# EAGLE design plinkykeeb_21Jan2022 (EAGLE 9.6.2)
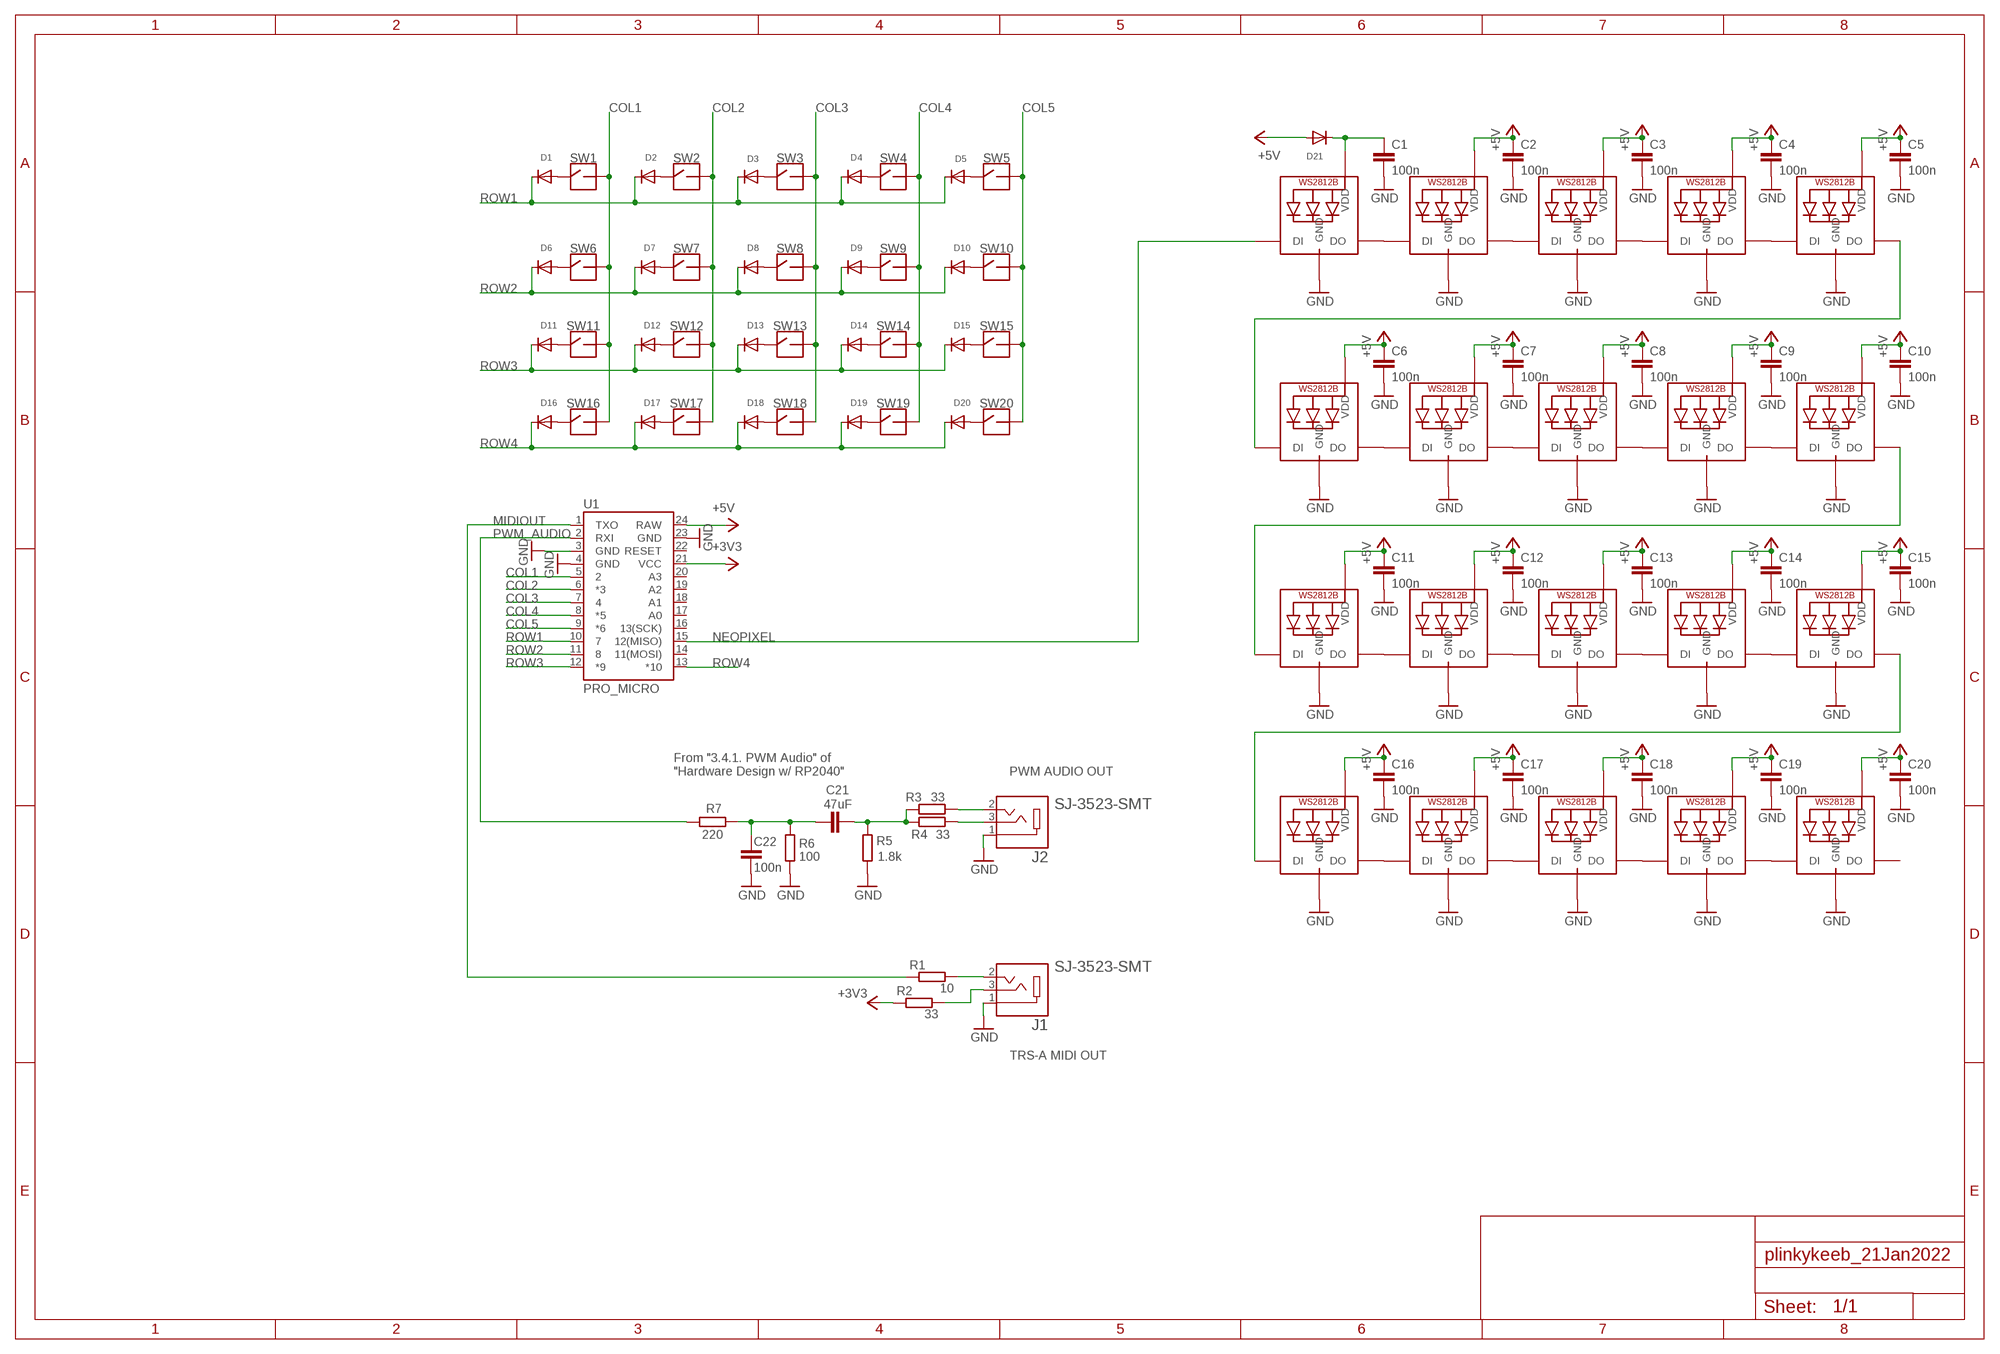
[diagram p0: schematic, sheet 1]

## Parts
C1  100n  C-EU025-024X044  [C025-024X044]
C2  100n  C-EU025-024X044  [C025-024X044]
C3  100n  C-EU025-024X044  [C025-024X044]
C4  100n  C-EU025-024X044  [C025-024X044]
C5  100n  C-EU025-024X044  [C025-024X044]
C6  100n  C-EU025-024X044  [C025-024X044]
C7  100n  C-EU025-024X044  [C025-024X044]
C8  100n  C-EU025-024X044  [C025-024X044]
C9  100n  C-EU025-024X044  [C025-024X044]
C10  100n  C-EU025-024X044  [C025-024X044]
C11  100n  C-EU025-024X044  [C025-024X044]
C12  100n  C-EU025-024X044  [C025-024X044]
C13  100n  C-EU025-024X044  [C025-024X044]
C14  100n  C-EU025-024X044  [C025-024X044]
C15  100n  C-EU025-024X044  [C025-024X044]
C16  100n  C-EU025-024X044  [C025-024X044]
C17  100n  C-EU025-024X044  [C025-024X044]
C18  100n  C-EU025-024X044  [C025-024X044]
C19  100n  C-EU025-024X044  [C025-024X044]
C20  100n  C-EU025-024X044  [C025-024X044]
C21  47uF  C-EUC0805  [C0805]
C22  100n  C-EUC0805  [C0805]
D1  DIODEDO-1N4148  [DO-1N4148]
D2  DIODEDO-1N4148  [DO-1N4148]
D3  DIODEDO-1N4148  [DO-1N4148]
D4  DIODEDO-1N4148  [DO-1N4148]
D5  DIODEDO-1N4148  [DO-1N4148]
D6  DIODEDO-1N4148  [DO-1N4148]
D7  DIODEDO-1N4148  [DO-1N4148]
D8  DIODEDO-1N4148  [DO-1N4148]
D9  DIODEDO-1N4148  [DO-1N4148]
D10  DIODEDO-1N4148  [DO-1N4148]
D11  DIODEDO-1N4148  [DO-1N4148]
D12  DIODEDO-1N4148  [DO-1N4148]
D13  DIODEDO-1N4148  [DO-1N4148]
D14  DIODEDO-1N4148  [DO-1N4148]
D15  DIODEDO-1N4148  [DO-1N4148]
D16  DIODEDO-1N4148  [DO-1N4148]
D17  DIODEDO-1N4148  [DO-1N4148]
D18  DIODEDO-1N4148  [DO-1N4148]
D19  DIODEDO-1N4148  [DO-1N4148]
D20  DIODEDO-1N4148  [DO-1N4148]
D21  DIODEDO-1N4148  [DO-1N4148]
J1  SJ-3523-SMT  [CUI_SJ-3523-SMT]
J2  SJ-3523-SMT  [CUI_SJ-3523-SMT]
LED1  MICROBUILDER_WS2812B_SK6812E  [MICROBUILDER_NEO3535_REVERSE]
LED2  MICROBUILDER_WS2812B_SK6812E  [MICROBUILDER_NEO3535_REVERSE]
LED3  MICROBUILDER_WS2812B_SK6812E  [MICROBUILDER_NEO3535_REVERSE]
LED4  MICROBUILDER_WS2812B_SK6812E  [MICROBUILDER_NEO3535_REVERSE]
LED5  MICROBUILDER_WS2812B_SK6812E  [MICROBUILDER_NEO3535_REVERSE]
LED6  MICROBUILDER_WS2812B_SK6812E  [MICROBUILDER_NEO3535_REVERSE]
LED7  MICROBUILDER_WS2812B_SK6812E  [MICROBUILDER_NEO3535_REVERSE]
LED8  MICROBUILDER_WS2812B_SK6812E  [MICROBUILDER_NEO3535_REVERSE]
LED9  MICROBUILDER_WS2812B_SK6812E  [MICROBUILDER_NEO3535_REVERSE]
LED10  MICROBUILDER_WS2812B_SK6812E  [MICROBUILDER_NEO3535_REVERSE]
LED11  MICROBUILDER_WS2812B_SK6812E  [MICROBUILDER_NEO3535_REVERSE]
LED12  MICROBUILDER_WS2812B_SK6812E  [MICROBUILDER_NEO3535_REVERSE]
LED13  MICROBUILDER_WS2812B_SK6812E  [MICROBUILDER_NEO3535_REVERSE]
LED14  MICROBUILDER_WS2812B_SK6812E  [MICROBUILDER_NEO3535_REVERSE]
LED15  MICROBUILDER_WS2812B_SK6812E  [MICROBUILDER_NEO3535_REVERSE]
LED16  MICROBUILDER_WS2812B_SK6812E  [MICROBUILDER_NEO3535_REVERSE]
LED17  MICROBUILDER_WS2812B_SK6812E  [MICROBUILDER_NEO3535_REVERSE]
LED18  MICROBUILDER_WS2812B_SK6812E  [MICROBUILDER_NEO3535_REVERSE]
LED19  MICROBUILDER_WS2812B_SK6812E  [MICROBUILDER_NEO3535_REVERSE]
LED20  MICROBUILDER_WS2812B_SK6812E  [MICROBUILDER_NEO3535_REVERSE]
R1  10  R-EU_R0805  [R0805]
R2  33  R-EU_R0805  [R0805]
R3  33  R-EU_R0805  [R0805]
R4  33  R-EU_R0805  [R0805]
R5  1.8k  R-EU_R0805  [R0805]
R6  100  R-EU_R0805  [R0805]
R7  220  R-EU_R0805  [R0805]
SW1  KAILH_SOCKETBOX_JADE  ADAFRUIT_ELECTROMECH_KBD_SWITCH_KAILH_SOCKETBOX_JADE_KAILH_SOCKET  [ADAFRUIT_ELECTROMECH_KAILH_SOCKET]
SW2  KAILH_SOCKETBOX_JADE  ADAFRUIT_ELECTROMECH_KBD_SWITCH_KAILH_SOCKETBOX_JADE_KAILH_SOCKET  [ADAFRUIT_ELECTROMECH_KAILH_SOCKET]
SW3  KAILH_SOCKETBOX_JADE  ADAFRUIT_ELECTROMECH_KBD_SWITCH_KAILH_SOCKETBOX_JADE_KAILH_SOCKET  [ADAFRUIT_ELECTROMECH_KAILH_SOCKET]
SW4  KAILH_SOCKETBOX_JADE  ADAFRUIT_ELECTROMECH_KBD_SWITCH_KAILH_SOCKETBOX_JADE_KAILH_SOCKET  [ADAFRUIT_ELECTROMECH_KAILH_SOCKET]
SW5  KAILH_SOCKETBOX_JADE  ADAFRUIT_ELECTROMECH_KBD_SWITCH_KAILH_SOCKETBOX_JADE_KAILH_SOCKET  [ADAFRUIT_ELECTROMECH_KAILH_SOCKET]
SW6  KAILH_SOCKETBOX_JADE  ADAFRUIT_ELECTROMECH_KBD_SWITCH_KAILH_SOCKETBOX_JADE_KAILH_SOCKET  [ADAFRUIT_ELECTROMECH_KAILH_SOCKET]
SW7  KAILH_SOCKETBOX_JADE  ADAFRUIT_ELECTROMECH_KBD_SWITCH_KAILH_SOCKETBOX_JADE_KAILH_SOCKET  [ADAFRUIT_ELECTROMECH_KAILH_SOCKET]
SW8  KAILH_SOCKETBOX_JADE  ADAFRUIT_ELECTROMECH_KBD_SWITCH_KAILH_SOCKETBOX_JADE_KAILH_SOCKET  [ADAFRUIT_ELECTROMECH_KAILH_SOCKET]
SW9  KAILH_SOCKETBOX_JADE  ADAFRUIT_ELECTROMECH_KBD_SWITCH_KAILH_SOCKETBOX_JADE_KAILH_SOCKET  [ADAFRUIT_ELECTROMECH_KAILH_SOCKET]
SW10  KAILH_SOCKETBOX_JADE  ADAFRUIT_ELECTROMECH_KBD_SWITCH_KAILH_SOCKETBOX_JADE_KAILH_SOCKET  [ADAFRUIT_ELECTROMECH_KAILH_SOCKET]
SW11  KAILH_SOCKETBOX_JADE  ADAFRUIT_ELECTROMECH_KBD_SWITCH_KAILH_SOCKETBOX_JADE_KAILH_SOCKET  [ADAFRUIT_ELECTROMECH_KAILH_SOCKET]
SW12  KAILH_SOCKETBOX_JADE  ADAFRUIT_ELECTROMECH_KBD_SWITCH_KAILH_SOCKETBOX_JADE_KAILH_SOCKET  [ADAFRUIT_ELECTROMECH_KAILH_SOCKET]
SW13  KAILH_SOCKETBOX_JADE  ADAFRUIT_ELECTROMECH_KBD_SWITCH_KAILH_SOCKETBOX_JADE_KAILH_SOCKET  [ADAFRUIT_ELECTROMECH_KAILH_SOCKET]
SW14  KAILH_SOCKETBOX_JADE  ADAFRUIT_ELECTROMECH_KBD_SWITCH_KAILH_SOCKETBOX_JADE_KAILH_SOCKET  [ADAFRUIT_ELECTROMECH_KAILH_SOCKET]
SW15  KAILH_SOCKETBOX_JADE  ADAFRUIT_ELECTROMECH_KBD_SWITCH_KAILH_SOCKETBOX_JADE_KAILH_SOCKET  [ADAFRUIT_ELECTROMECH_KAILH_SOCKET]
SW16  KAILH_SOCKETBOX_JADE  ADAFRUIT_ELECTROMECH_KBD_SWITCH_KAILH_SOCKETBOX_JADE_KAILH_SOCKET  [ADAFRUIT_ELECTROMECH_KAILH_SOCKET]
SW17  KAILH_SOCKETBOX_JADE  ADAFRUIT_ELECTROMECH_KBD_SWITCH_KAILH_SOCKETBOX_JADE_KAILH_SOCKET  [ADAFRUIT_ELECTROMECH_KAILH_SOCKET]
SW18  KAILH_SOCKETBOX_JADE  ADAFRUIT_ELECTROMECH_KBD_SWITCH_KAILH_SOCKETBOX_JADE_KAILH_SOCKET  [ADAFRUIT_ELECTROMECH_KAILH_SOCKET]
SW19  KAILH_SOCKETBOX_JADE  ADAFRUIT_ELECTROMECH_KBD_SWITCH_KAILH_SOCKETBOX_JADE_KAILH_SOCKET  [ADAFRUIT_ELECTROMECH_KAILH_SOCKET]
SW20  KAILH_SOCKETBOX_JADE  ADAFRUIT_ELECTROMECH_KBD_SWITCH_KAILH_SOCKETBOX_JADE_KAILH_SOCKET  [ADAFRUIT_ELECTROMECH_KAILH_SOCKET]
U1  PRO_MICRO  SPARKFUN_PRO_MICRO  [SPARKFUN_PRO_MICRO]

## Nets
+3V3: R2.2 U1.21(VCC)
+5V: C2.1 C3.1 C4.1 C5.1 C6.1 C7.1 C8.1 C9.1 C10.1 C11.1 C12.1 C13.1 C14.1 C15.1 C16.1 C17.1 C18.1 C19.1 C20.1 D21.A LED2.1-VDD(VDD) LED3.1-VDD(VDD) LED4.1-VDD(VDD) LED5.1-VDD(VDD) LED6.1-VDD(VDD) LED7.1-VDD(VDD) LED8.1-VDD(VDD) LED9.1-VDD(VDD) LED10.1-VDD(VDD) LED11.1-VDD(VDD) LED12.1-VDD(VDD) LED13.1-VDD(VDD) LED14.1-VDD(VDD) LED15.1-VDD(VDD) LED16.1-VDD(VDD) LED17.1-VDD(VDD) LED18.1-VDD(VDD) LED19.1-VDD(VDD) LED20.1-VDD(VDD) U1.24(RAW)
COL1: SW1.2 SW6.2 SW11.2 SW16.2 U1.5
COL2: SW2.2 SW7.2 SW12.2 SW17.2 U1.6(*3)
COL3: SW3.2 SW8.2 SW13.2 SW18.2 U1.7
COL4: SW4.2 SW9.2 SW14.2 SW19.2 U1.8(*5)
COL5: SW5.2 SW10.2 SW15.2 SW20.2 U1.9(*6)
GND: C1.2 C2.2 C3.2 C4.2 C5.2 C6.2 C7.2 C8.2 C9.2 C10.2 C11.2 C12.2 C13.2 C14.2 C15.2 C16.2 C17.2 C18.2 C19.2 C20.2 C22.2 J1.1 J2.1 LED1.3-GND(GND) LED2.3-GND(GND) LED3.3-GND(GND) LED4.3-GND(GND) LED5.3-GND(GND) LED6.3-GND(GND) LED7.3-GND(GND) LED8.3-GND(GND) LED9.3-GND(GND) LED10.3-GND(GND) LED11.3-GND(GND) LED12.3-GND(GND) LED13.3-GND(GND) LED14.3-GND(GND) LED15.3-GND(GND) LED16.3-GND(GND) LED17.3-GND(GND) LED18.3-GND(GND) LED19.3-GND(GND) LED20.3-GND(GND) R5.2 R6.1 U1.3(GND) U1.4(GND) U1.23(GND)
MIDIOUT: R1.2 U1.1(TXO)
N$1: LED1.2-DOUT(DO) LED2.4-DIN(DI)
N$2: LED2.2-DOUT(DO) LED3.4-DIN(DI)
N$3: LED3.2-DOUT(DO) LED4.4-DIN(DI)
N$4: LED4.2-DOUT(DO) LED5.4-DIN(DI)
N$5: LED5.2-DOUT(DO) LED6.4-DIN(DI)
N$6: D1.A SW1.1
N$7: D2.A SW2.1
N$8: D3.A SW3.1
N$9: D4.A SW4.1
N$10: D5.A SW5.1
N$11: C1.1 D21.C LED1.1-VDD(VDD)
N$12: D6.A SW6.1
N$13: D7.A SW7.1
N$14: D8.A SW8.1
N$15: D9.A SW9.1
N$16: D10.A SW10.1
N$17: D11.A SW11.1
N$18: D12.A SW12.1
N$19: D13.A SW13.1
N$20: D14.A SW14.1
N$21: D15.A SW15.1
N$22: D16.A SW16.1
N$23: D17.A SW17.1
N$24: D18.A SW18.1
N$25: D19.A SW19.1
N$26: D20.A SW20.1
N$27: LED7.2-DOUT(DO) LED8.4-DIN(DI)
N$28: LED8.2-DOUT(DO) LED9.4-DIN(DI)
N$29: LED9.2-DOUT(DO) LED10.4-DIN(DI)
N$30: LED10.2-DOUT(DO) LED11.4-DIN(DI)
N$31: LED11.2-DOUT(DO) LED12.4-DIN(DI)
N$32: LED6.2-DOUT(DO) LED7.4-DIN(DI)
N$34: LED13.2-DOUT(DO) LED14.4-DIN(DI)
N$35: LED14.2-DOUT(DO) LED15.4-DIN(DI)
N$36: LED15.2-DOUT(DO) LED16.4-DIN(DI)
N$37: LED16.2-DOUT(DO) LED17.4-DIN(DI)
N$38: LED17.2-DOUT(DO) LED18.4-DIN(DI)
N$39: LED12.2-DOUT(DO) LED13.4-DIN(DI)
N$40: LED19.2-DOUT(DO) LED20.4-DIN(DI)
N$41: LED18.2-DOUT(DO) LED19.4-DIN(DI)
N$42: J1.2 R1.1
N$43: J1.3 R2.1
N$44: J2.2 R3.1
N$46: J2.3 R4.1
N$47: C21.2 R3.2 R4.2 R5.1
N$48: C21.1 C22.1 R6.2 R7.1
NEOPIXEL: LED1.4-DIN(DI) U1.15(12(MISO))
PWM_AUDIO: R7.2 U1.2(RXI)
ROW1: D1.C D2.C D3.C D4.C D5.C U1.10
ROW2: D6.C D7.C D8.C D9.C D10.C U1.11
ROW3: D11.C D12.C D13.C D14.C D15.C U1.12(*9)
ROW4: D16.C D17.C D18.C D19.C D20.C U1.13(*10)
Unconnected: LED20.2-DOUT(DO) U1.14(11(MOSI)) U1.16(13(SCK)) U1.17(A0) U1.18(A1) U1.19(A2) U1.20(A3) U1.22(RESET)

## Notes on the sheet
- From "3.4.1. PWM Audio" of
  "Hardware Design w/ RP2040"
- PWM AUDIO OUT
- TRS-A MIDI OUT

## Library data of the parts
C1-C22 = rcl:C-EU: CAPACITOR, European symbol; SPICEPREFIX: C
D1-D21 = adafruit:DIODE: Diode SMADIODE - SMA Surface Mount Package 20V 1A Schottky Diode Digikey: 641-1014-6-ND DO-1N4148 - Through Hole Small Current Diode SOD-123 20V 1 A (.5mV Vf) Schottky Diode - Digikey: MBRX120TPMSCT-ND SOD-323 10V 570mA (.38mV Vf, 3ns) Schottky Diode - Digikey: ZLLS410CT-ND SOD-523 30V 30mA Schottky Diode (RB751S-40TE61) - Digikey: RB751S-40TE61CT-ND SOT23-R/W - SOT23 Package (R = Solder Paste/Reflow Ovens, W = Hand-Soldering) BAT54Film 40V 300mA - Digikey: 497-7162-1-ND
J1 J2 = SJ-3523-SMT:SJ-3523-SMT: Audio Jack Connector 3.5 mm Low Profile Surface Mount Stereo Jack, 3 Pin Right-Angle; CUI_PURCHASE_URL: https://www.cuidevices.com/product/interconnect/connectors/audio-connectors/jacks/sj-352x-smt-series?utm_source=snapeda.com&utm_medium=referral&utm_campaign=snapedaBOM; DESCRIPTION: 3.5 mm, Stereo, Right Angle, Surface Mount (SMT), 3 Conductors, 0~1 Internal Switches, Audio Jack Connector; DIGI-KEY_PART_NUMBER: CP-3523SJCT-ND; MF: CUI Devices; MP: SJ-3523-SMT-TR; PACKAGE: None; PURCHASE-URL: https://pricing.snapeda.com/search/part/SJ-3523-SMT-TR/?ref=eda
LED1-LED20 = Adafruit MacroPad 2040:MICROBUILDER_WS2812B
R1-R7 = rcl:R-EU_: RESISTOR, European symbol; SPICEPREFIX: R
SW1-SW20 = Adafruit MacroPad 2040:ADAFRUIT_ELECTROMECH_KBD_SWITCH_KAILH_SOCKET
U1 = SparkFun-Boards:SPARKFUN_PRO_MICRO: SparkFun Pro Micro Atmega32U4 compatible footprint. SparkFun Products: 3.3V/8MHz <https://www.sparkfun.com/products/12587> 5V/16MHz <https://www.sparkfun.com/products/12640>

## Board
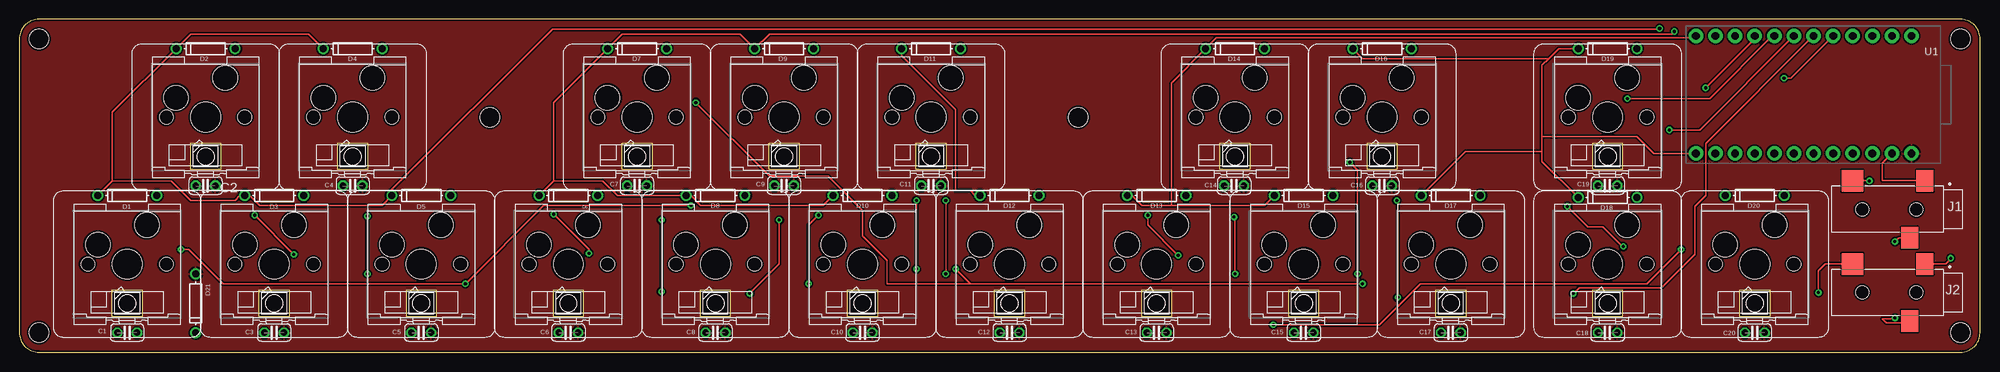
[diagram p1: board, top side]
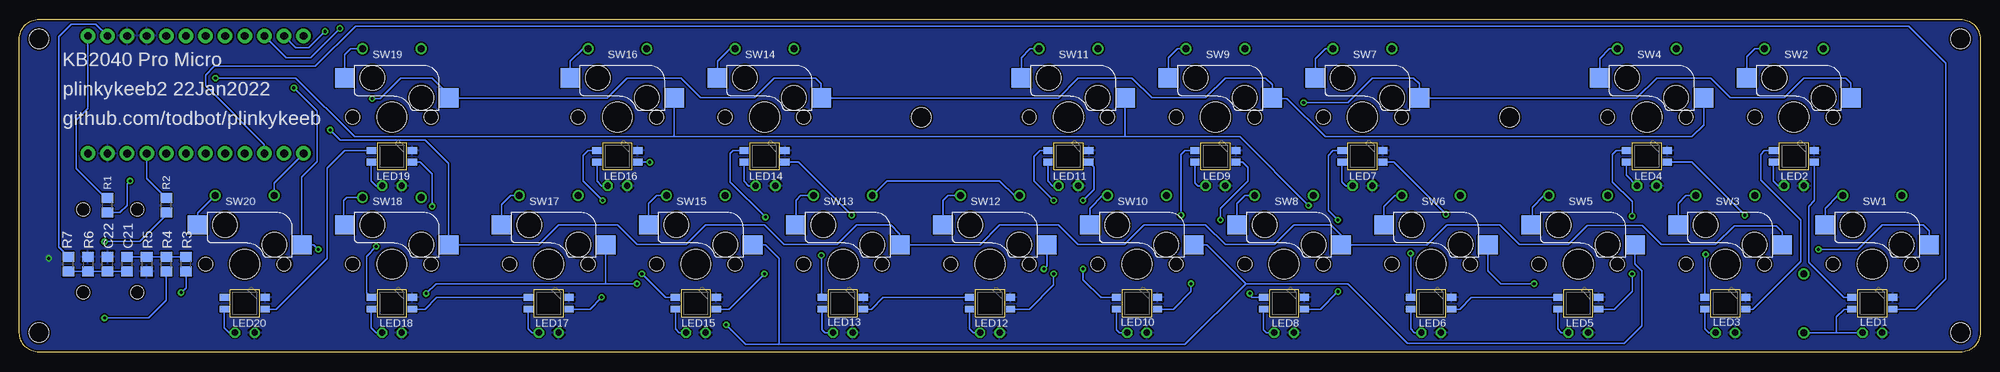
[diagram p2: board, bottom side, seen from below]

Size 254 x 43.18 mm. Coordinates in mm from the lower left corner, seen from the top.
Outline: 0,40.64 0,2.54 arc90 2.54,0 251.44,0 arc90 253.98,2.54 254,40.64 arc90 251.46,43.18 2.54,43.18 arc90 0,40.64
Copper layers (1*16): Top 0.035mm / dielectric 1.5mm / Bottom 0.035mm
Design rules "adafruit-rules-20180530": minimum track width 8mil, minimum drill 16mil, track to track 8mil, track to pad 8mil, pad to pad 8mil, via to via 8mil, smd to smd 8mil, copper to edge 10mil, drill to drill 8mil, minimum pad ring 10mil, minimum via ring 8mil, stop-mask expansion 4mil, vias tented up to drill 20mil, thermal gap 10mil
Holes 2.54 mm at 2.54,40.64 2.54,2.54 251.46,2.54 251.46,40.64 60.96,30.48 137.16,30.48

### Footprints (pad centres in the part's own frame; a part is rotated, then mirrored left to right if it is on the bottom)
C025-024X044 = drill 0.813 octagon: 1 -1.27,0; 2 1.27,0
C0805 = smd 1.3 x 1.5: 1 -0.95,0; 2 0.95,0
DO-1N4148 = drill 0.9: A -3.81,0; C 3.81,0
CUI_SJ-3523-SMT = smd 2.2 x 2.8: 1 -1.1,-3.7; 3 0.9,3.7 | smd 2.8 x 2.8: 2 8.3,-3.7 | hole 1.7: 0,0; 7,0
MICROBUILDER_NEO3535_REVERSE = smd 1.2 x 0.9 bottom: 1-VDD 2.65,-0.75; 2-DOUT 2.65,0.75; 3-GND -2.65,0.75; 4-DIN -2.65,-0.75
R0805 = smd 1.3 x 1.5: 1 -0.95,0; 2 0.95,0
ADAFRUIT_ELECTROMECH_KAILH_SOCKET = smd 2.55 x 2.5 bottom: 1 6.09,5.08; 2 -7.36,2.5 | hole 3.9: 0,0 | hole 3.2: 2.54,5.08; -3.81,2.54 | hole 1.813: 5.08,0; -5.08,0
SPARKFUN_PRO_MICRO = drill 1.016 pad 1.88: 1 -7.62,12.7; 2 -7.62,10.16; 3 -7.62,7.62; 4 -7.62,5.08; 5 -7.62,2.54; 6 -7.62,0; 7 -7.62,-2.54; 8 -7.62,-5.08; 9 -7.62,-7.62; 10 -7.62,-10.16; 11 -7.62,-12.7; 12 -7.62,-15.24; 13 7.62,-15.24; 14 7.62,-12.7; 15 7.62,-10.16; 16 7.62,-7.62; 17 7.62,-5.08; 18 7.62,-2.54; 19 7.62,0; 20 7.62,2.54; 21 7.62,5.08; 22 7.62,7.62; 23 7.62,10.16; 24 7.62,12.7

### Placement (x,y rotation side)
C1  13.97,2.54 180 top
C2  24.13,21.59 180 top
C3  33.02,2.54 180 top
C4  43.18,21.59 180 top
C5  52.07,2.54 180 top
C6  71.12,2.54 180 top
C7  80.01,21.59 180 top
C8  90.17,2.54 180 top
C9  99.06,21.59 180 top
C10  109.22,2.54 180 top
C11  118.11,21.59 180 top
C12  128.27,2.54 180 top
C13  147.32,2.54 180 top
C14  157.35,21.59 180 top
C15  166.37,2.54 180 top
C16  176.53,21.59 180 top
C17  185.42,2.54 180 top
C18  205.74,2.54 180 top
C19  205.74,21.59 180 top
C20  224.79,2.54 180 top
C21  240.03,11.43 90 bottom
C22  242.57,11.43 90 bottom
D1  13.97,20.32 180 top
D2  24.13,39.37 180 top
D3  33.02,20.32 180 top
D4  43.18,39.37 180 top
D5  52.07,20.32 180 top
D6  71.12,20.32 180 top
D7  80.01,39.37 180 top
D8  90.17,20.32 180 top
D9  99.06,39.37 180 top
D10  109.22,20.32 180 top
D11  118.11,39.37 180 top
D12  128.27,20.32 180 top
D13  147.32,20.32 180 top
D14  157.48,39.37 180 top
D15  166.37,20.32 180 top
D16  176.53,39.37 180 top
D17  185.42,20.32 180 top
D18  205.74,20.07 180 top
D19  205.74,39.37 180 top
D20  224.79,20.32 180 top
D21  22.86,6.35 270 top
J1  245.75,18.54 180 top
J2  245.75,7.75 180 top
LED1  13.97,6.35 0 top
LED2  24.13,25.4 0 top
LED3  33.02,6.35 0 top
LED4  43.18,25.4 0 top
LED5  52.07,6.35 0 top
LED6  71.12,6.35 0 top
LED7  80.01,25.4 0 top
LED8  90.17,6.35 0 top
LED9  99.06,25.4 0 top
LED10  109.22,6.35 0 top
LED11  118.11,25.4 0 top
LED12  128.27,6.35 0 top
LED13  147.32,6.35 0 top
LED14  157.48,25.4 0 top
LED15  166.37,6.35 0 top
LED16  176.53,25.4 0 top
LED17  185.42,6.35 0 top
LED18  205.74,6.35 0 top
LED19  205.74,25.4 0 top
LED20  224.79,6.35 0 top
R1  242.57,19.05 90 bottom
R2  234.95,19.05 90 bottom
R3  232.41,11.43 90 bottom
R4  234.95,11.43 90 bottom
R5  237.49,11.43 270 bottom
R6  245.11,11.43 270 bottom
R7  247.65,11.43 90 bottom
SW1  13.97,11.43 0 top
SW2  24.13,30.48 0 top
SW3  33.02,11.43 0 top
SW4  43.18,30.48 0 top
SW5  52.07,11.43 0 top
SW6  71.12,11.43 0 top
SW7  80.01,30.48 0 top
SW8  90.17,11.43 0 top
SW9  99.06,30.48 0 top
SW10  109.22,11.43 0 top
SW11  118.11,30.48 0 top
SW12  128.27,11.43 0 top
SW13  147.32,11.43 0 top
SW14  157.48,30.48 0 top
SW15  166.37,11.43 0 top
SW16  176.53,30.48 0 top
SW17  185.42,11.43 0 top
SW18  205.74,11.43 0 top
SW19  205.74,30.48 0 top
SW20  224.79,11.43 0 top
U1  232.41,33.4 270 top
U$1  [PLINKY_KEEB_BG_LOGO3]  0,0 0 top

### Tracks (layer width: path | path; a pad name or v marks a point on that pad's centre or on a via)
+3V3
  Bottom 0.203: R2.2 237.49,22.54 U1.21
+5V
  Bottom 0.203: C12.1 130.43,2.54 130.92,3.03 LED12.1-VDD | C15.1 168.53,2.54 169.02,3.03 LED15.1-VDD | C17.1 187.58,2.54 188.07,3.03 LED17.1-VDD | LED4.1-VDD 45.85,24.63 45.85,22.99 C4.1 | C19.1 207.77,21.59 208.41,22.23 208.41,24.63 LED19.1-VDD | LED20.1-VDD 227.46,5.58 227.46,3.17 226.82,2.54 C20.1 | C13.1 149.61,2.54 149.99,2.92 149.99,5.58 LED13.1-VDD | C10.1 111.51,2.54 111.89,2.92 111.89,5.58 LED10.1-VDD | C8.1 92.46,2.54 92.84,2.92 92.84,5.58 LED8.1-VDD | C6.1 73.28,2.54 73.77,3.03 LED6.1-VDD | C5.1 54.23,2.54 54.74,3.05 54.74,5.58 LED5.1-VDD | C3.1 35.18,2.54 35.67,3.03 LED3.1-VDD | C7.1 82.17,21.59 82.66,22.08 LED7.1-VDD | C9.1 101.35,21.59 101.71,21.95 LED9.1-VDD | C2.1 26.16,21.59 26.78,22.21 LED2.1-VDD | LED11.1-VDD 120.76,22.21 120.14,21.59 C11.1 | LED14.1-VDD 160.13,22.21 159.51,21.59 C14.1 | LED16.1-VDD 179.18,22.21 178.56,21.59 C16.1 | C18.1 207.77,2.54 208.39,3.16 LED18.1-VDD
  pour Top: -1.27,48.26 255.27,48.26 255.27,0 -1.27,0
COL1  (via drill 0.41)
  Top 0.203: v20.95,13.34 21.97,13.34 26.42,8.89 v57.78,8.89 67.94,19.05 v87,19.05 | U1.5 229.49,35.56 v228.6,35.56
  Bottom 0.203: v20.95,13.34 15.88,13.34 12.7,16.51 7.37,16.51 6.61,15.75 SW1.2 | 169.16,27.94 110.74,27.94 | v228.6,35.56 218.19,35.56 210.57,27.94 169.16,27.94 | v87,19.05 95.89,27.94 110.74,27.94 | v57.78,8.89 62.1,8.89 63.76,10.55 SW6.2 | SW11.2 110.75,27.95 110.74,27.94 | SW16.2 169.17,27.95 169.16,27.94
COL2  (via drill 0.41)
  Top 0.203: 123.19,8.89 v121.28,10.79 | v173.99,8.89 123.19,8.89 | U1.6 218.44,27.05 218.44,20.32 217.04,18.92 217.04,12.7 212.72,8.38 202.06,8.38 v201.29,7.62 | v87.63,32.38 97.16,22.86 104.78,22.86 109.22,18.41 109.22,15.11 112.39,11.94 112.39,8.89 123.19,8.89
  Bottom 0.203: v201.29,7.62 200.03,8.89 178.05,8.89 | v173.99,8.89 178.05,8.89 | v87.63,32.38 81.92,32.38 78.74,35.56 73.41,35.56 72.65,34.8 SW7.2 44.54,32.98 44.51,32.96 41.91,35.56 34.92,35.56 32.38,33.02 25.4,33.02 22.86,35.56 17.4,35.56 16.77,34.93 SW2.2 | SW12.2 120.91,11.17 v121.28,10.79 | SW17.2 178.06,8.9 178.05,8.89
COL3  (via drill 0.41)
  Top 0.203: U1.7 217.68,28.83 v213.74,28.83
  Bottom 0.203: SW3.2 25.66,15.62 26.42,16.38 31.88,16.38 34.29,13.97 41.27,13.97 43.74,16.43 50.88,16.43 53.34,13.97 59.69,13.97 62.23,16.51 69.09,16.51 71.67,13.93 SW8.2 82.81,15.25 84.07,16.51 88.9,16.51 91.44,13.97 97.79,13.97 100.33,16.51 108.33,16.51 110.87,13.97 116.84,13.97 119.38,16.51 127,16.51 129.58,13.93 SW13.2 139.96,15.37 141.1,16.51 145.54,16.51 148.08,13.97 154.94,13.97 157.48,16.51 165.1,16.51 167.64,13.97 173.99,13.97 176.53,16.51 184.15,16.51 186.73,13.93 SW18.2 198.39,24.5 201.42,27.53 212.45,27.53 v213.74,28.83
COL4  (via drill 0.41)
  Top 0.203: v208.28,32.89 218.95,32.89 227.08,41.02 U1.8
  Bottom 0.203: v208.28,32.89 207.26,32.89 204.6,35.56 200.53,35.56 198.38,33.41 SW19.2 177.84,32.98 175.26,35.56 168.28,35.56 165.74,33.02 158.75,33.02 156.21,35.56 150.88,35.56 150.12,34.8 SW14.2 119.42,32.98 116.84,35.56 109.86,35.56 107.31,33.02 100.33,33.02 97.79,35.56 92.58,35.56 91.7,34.68 SW9.2 91.61,32.89 89.79,32.89 84.84,27.94 37.34,27.94 35.82,29.46 SW4.2
COL5  (via drill 0.41)
  Top 0.203: v215.26,13.34 210.82,8.89 181.48,8.89 176.15,3.56 v162.43,3.56 | U1.9 224.79,40.64 v218.44,34.29
  Bottom 0.203: v218.44,34.29 215.39,31.24 215.39,24.77 217.43,22.73 SW20.2 215.86,13.93 v215.26,13.34 | 95.12,8.89 81.92,8.89 74.17,1.14 46.1,1.14 43.81,3.43 43.81,10.54 44.71,11.44 SW5.2 | 155.57,1.02 103,1.02 95.12,8.89 | v162.43,3.56 159.89,1.02 155.57,1.02 | SW15.2 157.31,13.93 155.57,12.19 155.57,1.02 | SW10.2 100.16,13.93 95.12,8.89
GND  (via drill 0.41)
  Top 0.203: U1.23 241.3,24.51 241.3,22.24 J1.1 | J2.1 249.51,11.45 250.19,12.12 v250.19,12.19
  pour Bottom: -1.27,46.99 255.27,46.99 255.27,0 -1.27,0
MIDIOUT
  Bottom 0.203: U1.1 245.11,31.62 246.63,30.1 246.63,23.81 242.82,20 R1.2
N$1
  Bottom 0.203: LED1.2-DOUT 17.64,7.1 22.23,11.68 22.23,18.92 21.48,19.67 LED2.4-DIN
N$2
  Bottom 0.203: LED3.4-DIN 29.45,5.6 23.24,11.81 23.24,17.14 28.45,22.35 28.45,25.65 27.95,26.15 LED2.2-DOUT
N$3  (via drill 0.41)
  Top 0.203: v30.48,17.78 v35.56,12.7
  Bottom 0.203: LED3.2-DOUT 35.67,12.59 v35.56,12.7 | LED4.4-DIN 37.35,24.65 v30.48,17.78
N$4  (via drill 0.41)
  Top 0.203: v45.09,17.65 v45.09,10.16
  Bottom 0.203: LED5.4-DIN 47.36,5.6 45.09,7.87 v45.09,10.16 | v45.09,17.65 45.09,19.56 47.62,22.1 47.62,25.65 47.13,26.15 LED4.2-DOUT
N$5
  Bottom 0.203: LED6.4-DIN 67.42,5.6 65.92,7.1 LED5.2-DOUT
N$6
  Bottom 0.203: D1.A 18.41,20.32 20.07,18.67 SW1.1
N$7
  Bottom 0.203: SW2.1 30.23,38.35 29.21,39.37 D2.A
N$8
  Bottom 0.203: SW3.1 39.12,19.3 38.1,20.32 D3.A
N$9
  Bottom 0.203: SW4.1 49.28,38.1 48.01,39.37 D4.A
N$10
  Bottom 0.203: D5.A 56.52,20.32 58.04,18.8 58.04,16.51 SW5.1
N$11
  Bottom 0.203: LED1.1-VDD 17.64,5.6 18.67,4.57 18.67,2.54 | C1.1 18.67,2.54 | 18.67,2.54 D21.C
N$12
  Bottom 0.203: SW6.1 77.22,18.92 75.82,20.32 D6.A
N$13
  Bottom 0.203: SW7.1 86.11,38.1 84.84,39.37 D7.A
N$14
  Bottom 0.203: SW8.1 96.27,19.3 95.25,20.32 D8.A
N$15
  Bottom 0.203: SW9.1 105.16,38.23 104.01,39.37 D9.A
N$16
  Bottom 0.203: SW10.1 115.32,18.67 113.67,20.32 D10.A
N$17
  Bottom 0.203: SW11.1 124.21,38.23 123.06,39.37 D11.A
N$18
  Bottom 0.203: SW12.1 134.37,19.68 133.73,20.32 D12.A
N$19
  Bottom 0.203: SW13.1 153.42,19.68 152.78,20.32 D13.A
N$20
  Bottom 0.203: D14.A 161.93,39.37 163.57,37.73 SW14.1
N$21
  Bottom 0.203: SW15.1 172.47,19.3 171.45,20.32 D15.A
N$22
  Bottom 0.203: D16.A 180.97,39.37 182.62,37.73 SW16.1
N$23
  Bottom 0.203: SW17.1 191.52,19.18 190.37,20.32 D17.A
N$24
  Bottom 0.203: SW18.1 211.96,16.64 211.96,19.68 211.58,20.07 D18.A
N$25
  Bottom 0.203: SW19.1 211.84,38.61 211.07,39.37 D19.A
N$26
  Bottom 0.203: SW20.1 230.88,18.04 D20.A
N$27  (via drill 0.41)
  Top 0.203: v83.19,17.14 v83.19,7.87
  Bottom 0.203: v83.19,17.14 84.45,18.41 84.45,25.53 83.83,26.15 LED7.2-DOUT | LED8.4-DIN 85.46,5.6 v83.19,7.87
N$28  (via drill 0.41)
  Top 0.203: v94.61,7.62 98.42,11.43 v98.42,17.14
  Bottom 0.203: v94.61,7.62 94.61,7.37 94.35,7.1 LED8.2-DOUT | v98.42,17.14 98.42,18.67 94.87,22.23 94.87,23.97 95.55,24.65 LED9.4-DIN
N$29  (via drill 0.41)
  Top 0.203: v102.23,8.89 102.23,16.51 v103.5,17.78
  Bottom 0.203: LED10.4-DIN 104.51,5.6 102.23,7.87 v102.23,8.89 | LED9.2-DOUT 103.01,26.15 103.5,25.65 v103.5,17.78
N$30  (via drill 0.41)
  Top 0.203: v116.2,19.68 v116.2,10.79
  Bottom 0.203: v116.2,10.79 116.2,9.4 113.91,7.1 LED10.2-DOUT | v116.2,19.68 114.81,21.08 114.81,24 LED11.4-DIN
N$31  (via drill 0.41)
  Top 0.203: v120.02,19.68 v120.02,10.16
  Bottom 0.203: v120.02,19.68 122.56,22.23 122.56,25.4 121.81,26.15 LED11.2-DOUT | LED12.4-DIN 123.18,5.6 120.02,8.76 v120.02,10.16
N$32  (via drill 0.41)
  Top 0.203: v69.22,17.91 73.79,13.34 v73.79,12.83
  Bottom 0.203: LED6.2-DOUT 73.77,12.81 v73.79,12.83 | LED7.4-DIN 75.96,24.65 v69.22,17.91
N$34  (via drill 0.41)
  Top 0.203: v146.18,17.78 146.18,16.51 v150.11,12.57
  Bottom 0.203: v150.11,12.57 150.11,7.24 LED13.2-DOUT | LED14.4-DIN 153.05,24.65 v146.18,17.78
N$35  (via drill 0.41)
  Top 0.203: v157.48,10.16 157.48,17.53 v157.35,17.53
  Bottom 0.203: v157.35,17.53 161.93,22.1 161.93,25.78 161.56,26.15 LED14.2-DOUT | LED15.4-DIN 162.04,5.6 v157.48,10.16
N$36  (via drill 0.41)
  Top 0.203: v173.35,10.16 173.35,23.62 v172.34,24.64
  Bottom 0.203: LED15.2-DOUT 170.29,7.1 v173.35,10.16 | LED16.4-DIN v172.35,24.65 v172.34,24.64
N$37  (via drill 0.41)
  Top 0.203: v178.44,19.68 178.56,19.56 v178.56,7.11
  Bottom 0.203: v178.56,7.11 180.07,5.6 LED17.4-DIN | v178.44,19.68 180.97,22.23 180.97,25.53 180.35,26.15 LED16.2-DOUT
N$38
  Bottom 0.203: LED18.4-DIN 201.41,5.6 199.91,7.1 LED17.2-DOUT
N$39
  Bottom 0.203: LED13.4-DIN 143.62,5.6 142.12,7.1 LED12.2-DOUT
N$40
  Bottom 0.203: LED20.4-DIN 220.71,5.6 214.12,12.19 214.12,23.88 211.85,26.15 LED19.2-DOUT
N$41  (via drill 0.41)
  Top 0.203: v207.77,13.72 207.65,13.72 205.1,16.26 203.2,16.26 v200.53,18.92
  Bottom 0.203: v200.53,18.92 200.53,23.11 202.07,24.65 LED19.4-DIN | v207.77,13.72 209.03,12.46 209.03,7.74 LED18.2-DOUT
N$42  (via drill 0.41)
  Top 0.203: v239.65,22.23 239.63,22.24 J1.2
  Bottom 0.203: R1.1 240.98,18.1 240.03,19.05 240.03,21.84 v239.65,22.23
N$43  (via drill 0.41)
  Top 0.203: v242.95,14.35 243.44,14.84 J1.3
  Bottom 0.203: R2.1 234.95,17.78 238.38,14.35 v242.95,14.35
N$44  (via drill 0.41)
  Top 0.203: J2.2 233.95,11.45 233.04,10.54 v233.04,7.75
  Bottom 0.203: R3.1 232.41,8.38 v233.04,7.75
N$46  (via drill 0.41)
  Top 0.203: v242.95,4.45 242.82,4.32 241.3,4.32 241.81,3.81 244.61,3.81 J2.3
  Bottom 0.203: R4.1 234.95,6.73 237.24,4.45 v242.95,4.45
N$47
  Bottom 0.203: R3.2 R4.2 R5.1 C21.2
N$48
  Bottom 0.203: C21.1 C22.1 R6.2 R7.1
NEOPIXEL
  Bottom 0.203: LED1.4-DIN 8.37,5.6 4.45,9.53 4.45,37.47 9.27,42.29 210.44,42.29 215.65,37.08 228.73,37.08 229.87,35.94 229.87,34.54 222.25,26.92 U1.15
PWM_AUDIO
  Bottom 0.203: U1.2 244.09,42.55 247.28,42.55 248.92,40.91 248.92,13.65 R7.2
ROW1  (via drill 0.41)
  Top 0.203: 12.06,22.23 D1.C | 12.06,22.23 19.68,22.23 22.23,19.68 27.94,19.68 28.57,20.32 D3.C 29.84,20.32 31.11,19.05 46.99,19.05 D5.C 48.26,21.08 69.09,41.91 212.4,41.91 v212.47,41.99 | 12.06,22.23 12.06,31.11 D2.C 22.23,41.27 37.47,41.27 D4.C
  Bottom 0.203: U1.10 219.46,38.23 216.23,38.23 v212.47,41.99
ROW2  (via drill 0.41)
  Top 0.203: 69.22,22.23 D6.C | 69.22,22.23 75.56,22.23 77.47,20.32 D8.C 87,20.32 88.27,19.05 104.14,19.05 D10.C | 69.22,22.23 69.22,32.38 D7.C 78.11,41.27 93.34,41.27 D9.C 97.16,41.27 214.05,41.27 v214.38,41.6
  Bottom 0.203: U1.11 218.19,39.5 216.48,39.5 v214.38,41.6
ROW3
  Top 0.203: D11.C 114.3,38.48 121.28,31.5 121.28,20.95 123.19,20.95 123.83,20.32 D12.C | D15.C 161.29,19.05 149.22,19.05 | 149.22,19.05 145.41,19.05 144.15,20.32 D13.C | 149.22,19.05 149.22,34.92 D14.C 155.07,40.77 216.92,40.77 U1.12
  Bottom 0.203: D13.C 141.6,22.23 127,22.23 125.09,20.32 D12.C
ROW4
  Top 0.203: 198.12,38.1 197.23,37.21 197.23,27.94 | D17.C 187.32,26.04 197.23,26.04 | D19.C 199.39,39.37 198.12,38.1 | D16.C 173.99,38.1 198.12,38.1 | 197.23,27.94 197.23,26.04 | U1.13 211.71,25.78 209.55,27.94 197.23,27.94 | D18.C 197.23,24.77 197.23,26.04
  Bottom 0.203: D20.C 220.98,21.97 U1.13

### Text on the board
bPlace: KB2040 Pro Micro | plinkykeeb2 22Jan2022 | github.com/todbot/plinkykeeb